# Altium schematic sheet USB_to_UART.SchDoc
size A4; SheetNumber: 3; SheetTotal: 4
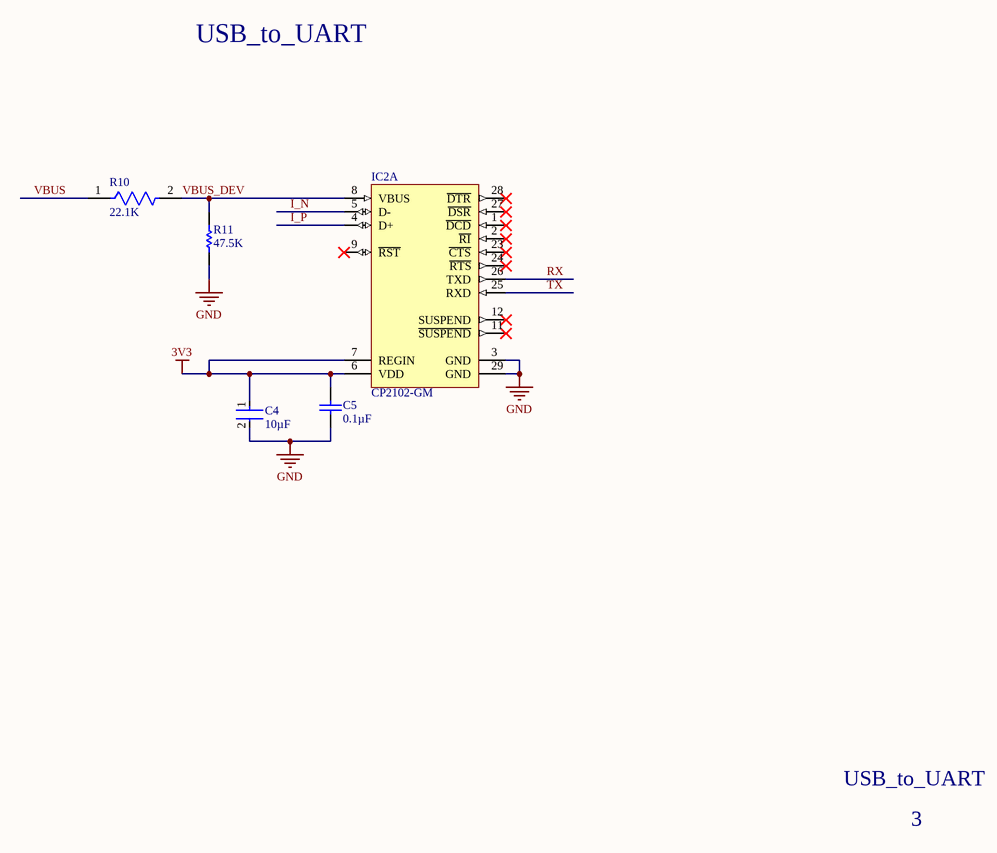
[diagram p0: USB_to_UART.SchDoc]

## Parts
C4  10µF  [FP-CC0603-0_15-0_95-IPC_B]
C5  0.1µF  [CAPC1608X87X35NL15T15]
IC2  CP2102-GM  [SLAB-QFN-28-3125x3125TP_N]  (part A of 2)
R10  22.1K  [FP-RC0603-0_55-MFG]
R11  47.5K  [RESC1608X55X30LL15T15]

## Nets
3V3: C4.1 C5.2 IC2.6(VDD) IC2.7(REGIN)
GND: C4.2 C5.1 IC2.3(GND) IC2.29(GND) R11.1
I_N: IC2.5(D-)
I_P: IC2.4(D+)
RX: IC2.26(TXD)
TX: IC2.25(RXD)
VBUS: R10.1
VBUS_DEV: IC2.8(VBUS) R10.2 R11.2

Not connected (* = marked no-connect by the designer): IC2 1(~{DCD})* 2(~{RI})* 9(~{RST})* 11(~{SUSPEND})* 12(SUSPEND)* 23(~{CTS})* 24(~{RTS})* 27(~{DSR})* 28(~{DTR})*

## Notes on the sheet
- USB_to_UART
- 3

## Library data of the parts
C4 = CMP-03422-001506-1: CAP CER 10UF 6.3V X5R 0603; Tolerance: 20%; Voltage: 4V; Depth: 0.8mm; Halogen Free: Halogen Free; Case Code (Metric): 1608; Height: 0.8mm; Voltage Rating (DC): 6.3V; Construction: Flat; Series: CC; Lead Free: Lead Free; Min Operating Temperature: -55°C; Capacitance: 10uF; Thickness: 0.035inch; Max Operating Temperature: 85°C; Termination: SMD/SMT; Length: 1.6mm; Resistor Type: Ceramic; Dielectric: X5R; Mount: Surface Mount; Width: 0.031inch; Case/Package: 0603; Packaging: Tape and Reel; Case Code (Imperial): 0603; Voltage Rating: 6.3V; Weight: 7.1E-05oz; Radiation Hardening: No; RoHS Compliant: Yes
C5 = CMP-1035-02576-2: Part Number: C0603C104K9RACTU; Manufacturer: Kemet
IC2 = CMP-0511-00012-1: Single-Chip USB to UART Bridge, 1024 Bytes EEPROM, -40 to 85 degC, 28-pin QFN, Tube; Manufacturer: Silicon Labs; Internal Oscillator: TRUE; Sub-Family: USB Bridges; ComponentLink3Description: Package Specification; PackageDescription: 28-Pin Quad-Flat No-Leads Package, Body 5 x 5 mm, Pitch 0.5 mm; PartNumber: CP2102-GM; EEPROM: 1024 Bytes; Mounting Technology: Surface Mount; ComponentLink2URL: http://www.silabs.com/Support%20Documents/TechnicalDocs/CP2102-9.pdf; DatasheetVersion: Rev. 1.5; ComponentLink1URL: http://www.silabs.com/; ComponentLink2Description: Datasheet; Code_JEDEC: MO-220; PackageReference: QFN-28; Code_IPC: J-STD-020C; ComponentLink3URL: http://www.silabs.com/Support%20Documents/TechnicalDocs/C8051T61x.pdf; ComponentLink1Description: Manufacturer URL
R10 = CMP-03412-037792-1: RES SMD 22.1K OHM 1% 1/10W 0603; Voltage Rating: 50V; Power Rating: 100mW; Temperature Coefficient: 100ppm/°C; Resistance: 22.1kR; Width: 0.8mm; Packaging: Tape and Reel; Series: RC; Size Code: 0603; Case Code (Imperial): 0603; Package Quantity: 5000; Min Operating Temperature: -55°C; Tolerance: 1%; Voltage Rating (DC): 50V; Lead Free: Lead Free; Case Code (Metric): 1608; Termination: SMD/SMT; Height: 0.45mm; Case/Package: 0603; Length: 1.6mm; Max Operating Temperature: 155°C
R11 = CMP-2000-00527-1: Manufacturer: Panasonic; Part Number: ERJ-3EKF4752V